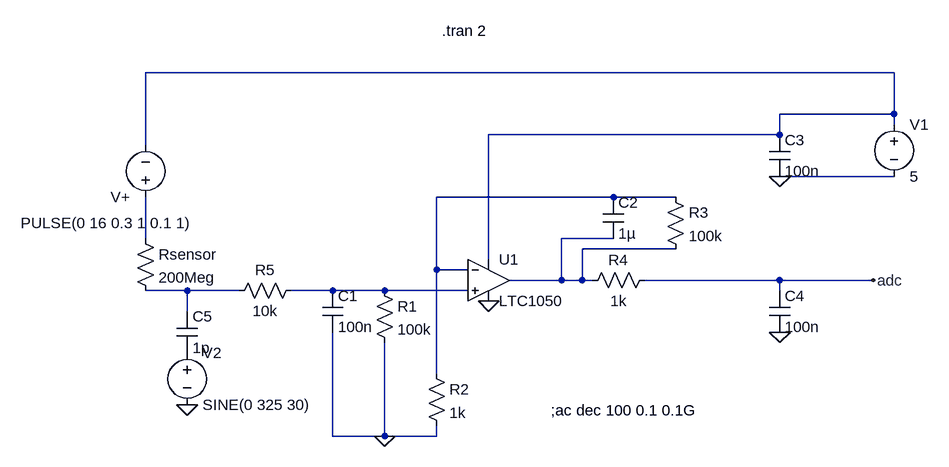
[diagram p0: schematic LtspiceLTC1050 .asc]
LtspiceLTC1050 .asc, the LTspice schematic file:
Version 4
SHEET 1 1012 680
WIRE 832 -192 -320 -192
WIRE 832 -128 832 -192
WIRE 832 -128 656 -128
WIRE 832 -112 832 -128
WIRE 656 -96 656 -128
WIRE 656 -96 208 -96
WIRE -320 -80 -320 -192
WIRE 832 -32 656 -32
WIRE 400 0 128 0
WIRE 496 0 400 0
WIRE -320 64 -320 0
WIRE 400 64 320 64
WIRE 496 80 352 80
WIRE 208 96 208 -96
WIRE 128 112 128 0
WIRE 176 112 128 112
WIRE 320 128 320 64
WIRE 320 128 240 128
WIRE 352 128 352 80
WIRE 352 128 320 128
WIRE 368 128 352 128
WIRE 656 128 448 128
WIRE 800 128 656 128
WIRE -256 144 -320 144
WIRE -176 144 -256 144
WIRE -32 144 -96 144
WIRE 48 144 -32 144
WIRE 176 144 48 144
WIRE 656 144 656 128
WIRE -256 176 -256 144
WIRE 128 272 128 112
WIRE -32 368 -32 208
WIRE 48 368 48 224
WIRE 48 368 -32 368
WIRE 128 368 128 352
WIRE 128 368 48 368
FLAG 656 -32 0
FLAG 656 208 0
FLAG 208 160 0
FLAG 48 368 0
FLAG 800 128 adc
FLAG -256 320 0
SYMBOL OpAmps\\LTC1050 208 64 R0
SYMATTR InstName U1
SYMBOL res 32 128 R0
SYMATTR InstName R1
SYMATTR Value 100k
SYMBOL res 112 256 R0
SYMATTR InstName R2
SYMATTR Value 1k
SYMBOL res 480 -16 R0
SYMATTR InstName R3
SYMATTR Value 100k
SYMBOL res 464 112 R90
WINDOW 0 0 56 VBottom 2
WINDOW 3 32 56 VTop 2
SYMATTR InstName R4
SYMATTR Value 1k
SYMBOL res -80 128 R90
WINDOW 0 0 56 VBottom 2
WINDOW 3 32 56 VTop 2
SYMATTR InstName R5
SYMATTR Value 10k
SYMBOL cap -48 144 R0
SYMATTR InstName C1
SYMATTR Value 100n
SYMBOL cap 384 0 R0
SYMATTR InstName C2
SYMATTR Value 1µ
SYMATTR SpiceLine V=16 Irms=0 Rser=0 Lser=0
SYMBOL cap 640 -96 R0
SYMATTR InstName C3
SYMATTR Value 100n
SYMBOL cap 640 144 R0
SYMATTR InstName C4
SYMATTR Value 100n
SYMBOL voltage 832 -128 R0
WINDOW 123 0 0 Left 0
WINDOW 39 0 0 Left 0
SYMATTR InstName V1
SYMATTR Value 5
SYMBOL res -336 48 R0
SYMATTR InstName Rsensor
SYMATTR Value 200Meg
SYMBOL voltage -320 16 R180
WINDOW 3 -71 -24 Left 2
WINDOW 123 24 124 Left 2
WINDOW 39 0 0 Left 0
SYMATTR InstName V+
SYMATTR Value PULSE(0 16 0.3 1 0.1 1)
SYMBOL cap -272 176 R0
SYMATTR InstName C5
SYMATTR Value 1p
SYMBOL voltage -256 224 R0
WINDOW 123 24 124 Left 2
WINDOW 39 0 0 Left 0
SYMATTR InstName V2
SYMATTR Value SINE(0 325 30)
TEXT 304 328 Left 2 !;ac dec 100 0.1 0.1G
TEXT 136 -256 Left 2 !.tran 2

The netlist it stands for:
* LtspiceLTC1050 .asc
XU1 N006 N002 N001 0 N004 LTC1050  ; pins In+ In- V+ V- OUT
R1 N006 0 100k
R2 N002 0 1k
R3 N002 N004 100k
R4 adc N004 1k
R5 N006 N005 10k
C1 N006 0 100n
C2 N002 N004 1µ V=16 Irms=0 Rser=0 Lser=0
C3 N001 0 100n
C4 adc 0 100n
V1 N001 0 5
Rsensor N003 N005 200Meg
V+ N003 N001 PULSE(0 16 0.3 1 0.1 1)
C5 N005 P001 1p
V2 P001 0 SINE(0 325 30)
;ac dec 100 0.1 0.1G
.tran 2
.lib LTC.lib
.backanno
.end